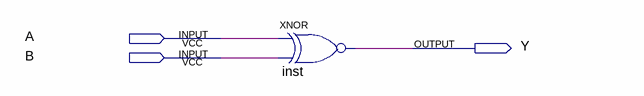
[diagram p0: schematic sheet]
// Quartus schematic CONG_XNOR.bdf as structural Verilog: 1 symbols, 3 pins
module CONG_XNOR (
  input  A,
  input  B,
  output Y
);

  xnor inst (Y, A, B);
endmodule
